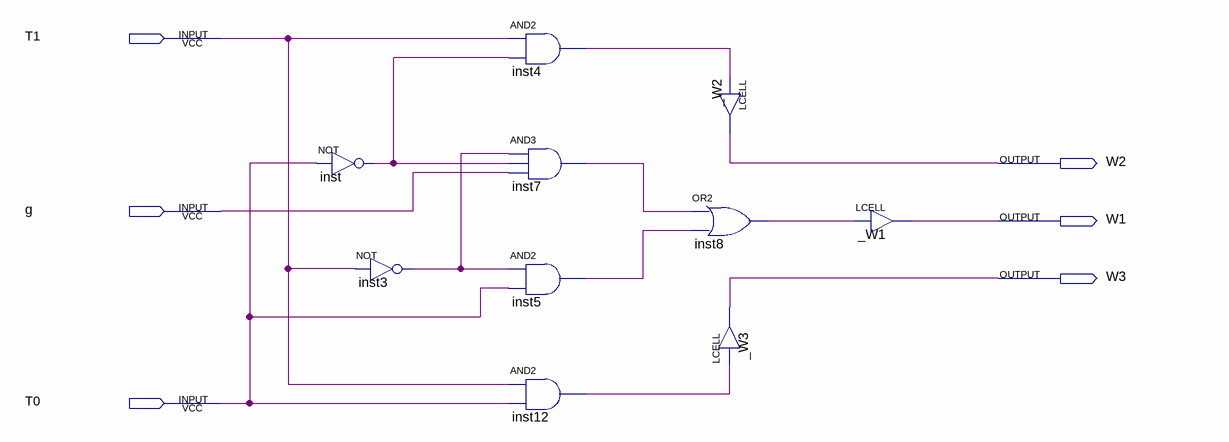
[diagram p0: schematic sheet]
// Quartus schematic ctrlSeq.bdf as structural Verilog: 10 symbols, 6 pins
module ctrlSeq (
  input  T1,
  input  g,
  input  T0,
  output W2,
  output W1,
  output W3
);

  wire inst3_out, inst4_out, inst5_out, inst7_out, inst8_out, inst12_out, inst_out;

  not inst (inst_out, T0);
  not inst3 (inst3_out, T1);
  and inst4 (inst4_out, T1, inst_out);
  and inst7 (inst7_out, inst3_out, inst_out, g);
  and inst5 (inst5_out, inst3_out, T0);
  and inst12 (inst12_out, T1, T0);
  LCELL _W2 (.IN(inst4_out), .OUT(W2));
  or inst8 (inst8_out, inst7_out, inst5_out);
  LCELL _W3 (.IN(inst12_out), .OUT(W3));
  LCELL _W1 (.IN(inst8_out), .OUT(W1));
endmodule
